# Altium schematic sheet MCU.SchDoc
size B; SheetNumber: 3; SheetTotal: 9
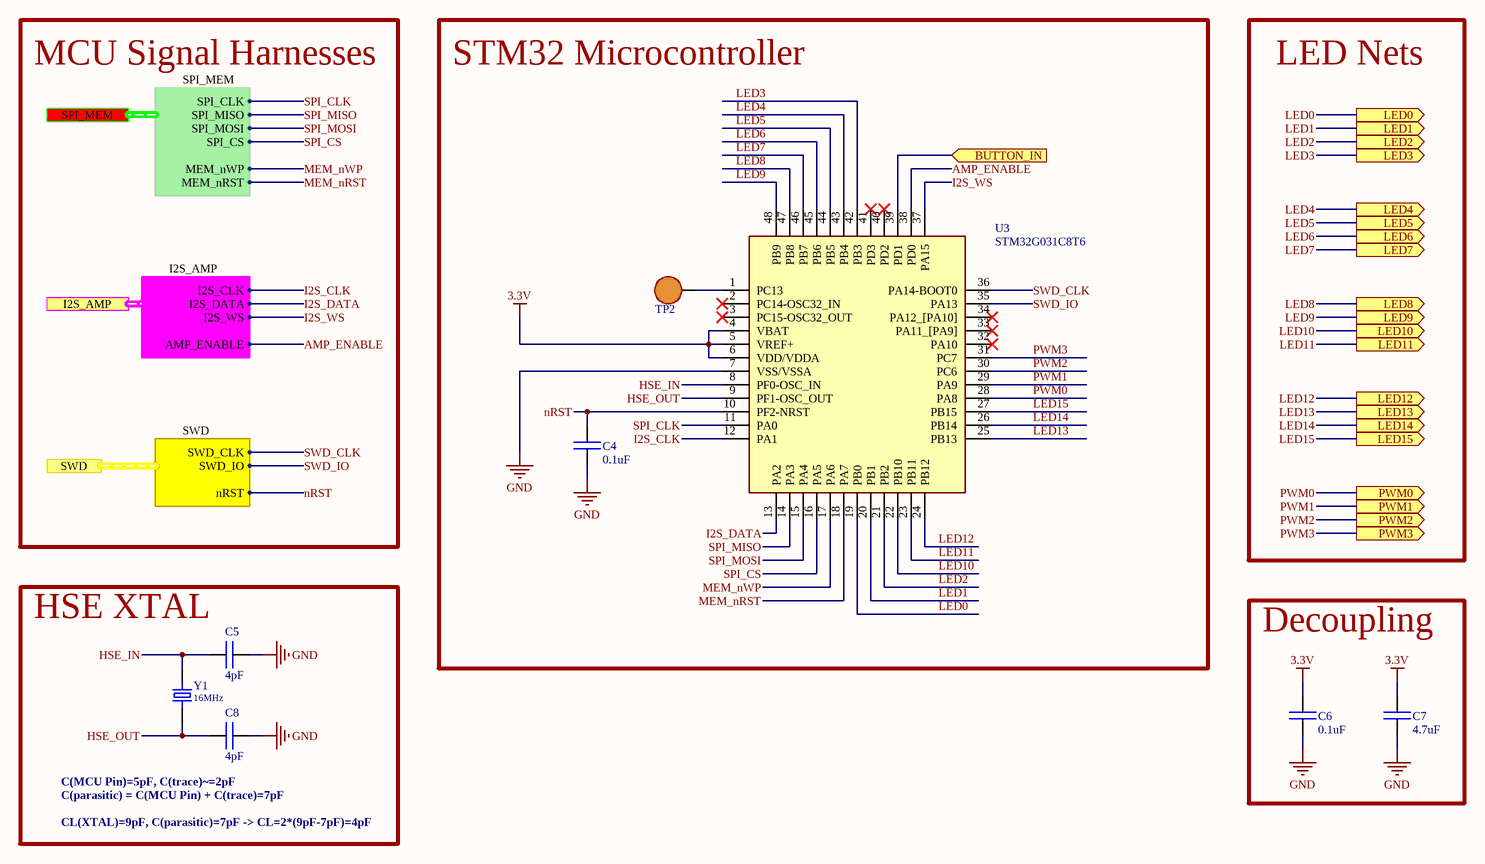
[diagram p0: MCU.SchDoc]

## Parts
C4  value 0.1uF  [0402C]  (hidden comment: CAP)
C5  value 4pF  [0402C]  (hidden comment: CAP)
C6  value 0.1uF  [0402C]  (hidden comment: CAP)
C7  value 4.7uF  [0402C]  (hidden comment: CAP)
C8  value 4pF  [0402C]  (hidden comment: CAP)
TP2  RCWCTE  [RCWCTE]  (value not drawn)
U3  STM32G031C8T6  [48-LQFP]
Y1  16MHz  [4-SMD_NL]

## Blocks framed on the sheet
STM32 Microcontroller: C4 TP2 U3
HSE XTAL: C5 C8 Y1
Decoupling: C6 C7

## Ports
BUTTON_IN (in, see Christmas-2024_TSO-PCB_MASTER[2B], Button[2B]), I2S_AMP (harness I2S_AMP, see Christmas-2024_TSO-PCB_MASTER[2C], Amplifier[1B]), LED0 (out, see Christmas-2024_TSO-PCB_MASTER[3B]), LED1 (out, see Christmas-2024_TSO-PCB_MASTER[3B]), LED2 (out, see Christmas-2024_TSO-PCB_MASTER[3B]), LED3 (out, see Christmas-2024_TSO-PCB_MASTER[3B]), LED4 (out, see Christmas-2024_TSO-PCB_MASTER[3B]), LED5 (out, see Christmas-2024_TSO-PCB_MASTER[3B]), LED6 (out, see Christmas-2024_TSO-PCB_MASTER[3B]), LED7 (out, see Christmas-2024_TSO-PCB_MASTER[3B]), LED8 (out, see Christmas-2024_TSO-PCB_MASTER[3C]), LED9 (out, see Christmas-2024_TSO-PCB_MASTER[3C]), LED10 (out, see Christmas-2024_TSO-PCB_MASTER[3C]), LED11 (out, see Christmas-2024_TSO-PCB_MASTER[3C]), LED12 (out, see Christmas-2024_TSO-PCB_MASTER[3C]), LED13 (out, see Christmas-2024_TSO-PCB_MASTER[3C]), LED14 (out, see Christmas-2024_TSO-PCB_MASTER[3C]), LED15 (out, see Christmas-2024_TSO-PCB_MASTER[3C]), PWM0 (out, see Christmas-2024_TSO-PCB_MASTER[3B]), PWM1 (out, see Christmas-2024_TSO-PCB_MASTER[3B]), PWM2 (out, see Christmas-2024_TSO-PCB_MASTER[3C]), PWM3 (out, see Christmas-2024_TSO-PCB_MASTER[3C]), SPI_MEM (harness SPI_MEM, see Christmas-2024_TSO-PCB_MASTER[2B], Memory-Buffer[1B]), SWD (harness SWD, see Christmas-2024_TSO-PCB_MASTER[2B], SWD[2B])

## Harnesses
SPI_MEM: SPI_CLK, SPI_MOSI, SPI_CS, SPI_MISO, MEM_nWP, MEM_nRST
I2S_AMP: I2S_CLK, I2S_DATA, I2S_WS, AMP_ENABLE
SWD: nRST, SWD_CLK, SWD_IO

## Nets
3.3V: C6.2 C7.2 U3.4(VBAT) U3.5(VREF+) U3.6(VDD/VDDA)
GND: C4.1 C5.1 C6.1 C7.1 C8.1 U3.7(VSS/VSSA)
AMP_ENABLE: U3.38(PD0) ; port I2S_AMP.AMP_ENABLE
BUTTON_IN: U3.39(PD1) ; port BUTTON_IN
HSE_IN: C5.2 U3.8(PF0-OSC_IN) Y1.2
HSE_OUT: C8.2 U3.9(PF1-OSC_OUT) Y1.1
I2S_CLK: U3.12(PA1) ; port I2S_AMP.I2S_CLK
I2S_DATA: U3.13(PA2) ; port I2S_AMP.I2S_DATA
I2S_WS: U3.37(PA15) ; port I2S_AMP.I2S_WS
LED0: U3.19(PB0) ; port LED0
LED1: U3.20(PB1) ; port LED1
LED2: U3.21(PB2) ; port LED2
LED3: U3.42(PB3) ; port LED3
LED4: U3.43(PB4) ; port LED4
LED5: U3.44(PB5) ; port LED5
LED6: U3.45(PB6) ; port LED6
LED7: U3.46(PB7) ; port LED7
LED8: U3.47(PB8) ; port LED8
LED9: U3.48(PB9) ; port LED9
LED10: U3.22(PB10) ; port LED10
LED11: U3.23(PB11) ; port LED11
LED12: U3.24(PB12) ; port LED12
LED13: U3.25(PB13) ; port LED13
LED14: U3.26(PB14) ; port LED14
LED15: U3.27(PB15) ; port LED15
MEM_nRST: U3.18(PA7) ; port SPI_MEM.MEM_nRST
MEM_nWP: U3.17(PA6) ; port SPI_MEM.MEM_nWP
nRST: C4.2 U3.10(PF2-NRST) ; port SWD.nRST
PWM0: U3.28(PA8) ; port PWM0
PWM1: U3.29(PA9) ; port PWM1
PWM2: U3.30(PC6) ; port PWM2
PWM3: U3.31(PC7) ; port PWM3
SPI_CLK: U3.11(PA0) ; port SPI_MEM.SPI_CLK
SPI_CS: U3.16(PA5) ; port SPI_MEM.SPI_CS
SPI_MISO: U3.14(PA3) ; port SPI_MEM.SPI_MISO
SPI_MOSI: U3.15(PA4) ; port SPI_MEM.SPI_MOSI
SWD_CLK: U3.36(PA14-BOOT0) ; port SWD.SWD_CLK
SWD_IO: U3.35(PA13) ; port SWD.SWD_IO
NetTP2_1: TP2.1 U3.1(PC13)

Not connected (* = marked no-connect by the designer): U3 2(PC14-OSC32_IN)* 3(PC15-OSC32_OUT)* 32(PA10)* 33(PA11_[PA9])* 34(PA12_[PA10])* 40(PD2)* 41(PD3)*

## Notes on the sheet
- MCU Signal Harnesses
- LED Nets
- CL(XTAL)=9pF, C(parasitic)=7pF -> CL=2*(9pF-7pF)=4pF
- (near C8) C(MCU Pin)=5pF, C(trace)~=2pF
- C(parasitic) = C(MCU Pin) + C(trace)=7pF

## Library data of the parts
C4 C6 = CAP: Capacitor; MFR: Samsung; MFR PN: CL05B104KP5NNNC; Type: SMD
C5 C8 = CAP: Capacitor; MFR: Murata; MFR PN: GJM1555C1H4R0BB01D; Type: SMD
C7 = CAP: Capacitor; MFR: Samsung; MFR PN: CL05A475MP5NRNC; Type: SMD
TP2 = TEST POINT: Test Point, Surface Mount; MFR: KOA Speer Electronics, Inc.; MFR PN: RCWCTE; Type: SMD
U3 = STM32G031C6T6: STM32G031C6T6 - ARM MCU, STM32 Family STM32G0 Series Microcontrollers, ARM Cortex-M0+, 32bit, 64 MHz, 64 KB, 8 KB; MFR: STMicroelectronics; MFR PN: STM32G031C8T6; Vendor: *; Vendor PN: *; Vendor Link: *; Type: SMD
Y1 = 16 MHz XTAL: CRYSTAL 16.0000MHZ 9PF SMD; MFR: EPSON; MFR PN: TSX-3225 16.0000MF09Z-AC0; Type: SMD; Frequency: 16MHz